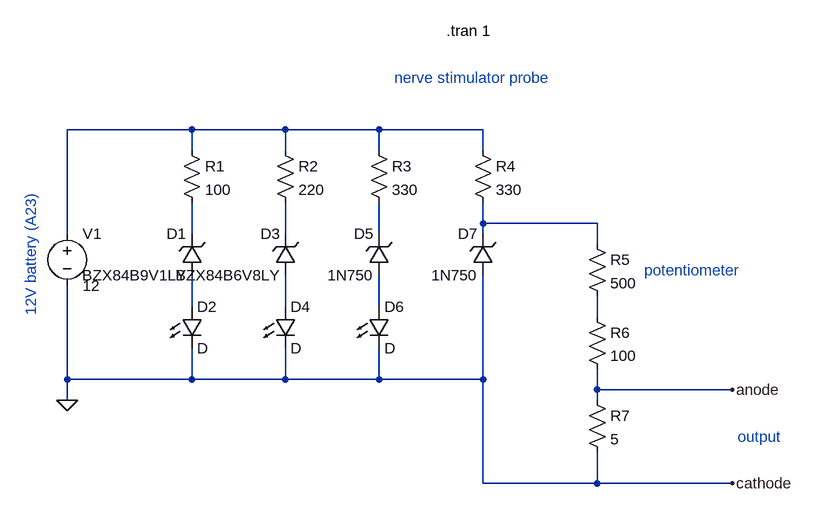
[diagram p0: schematic nerve_stimulator_probe.asc]
nerve_stimulator_probe.asc, the LTspice schematic file:
Version 4
SHEET 1 1136 680
WIRE 192 -32 0 -32
WIRE 336 -32 192 -32
WIRE 480 -32 336 -32
WIRE 640 -32 480 -32
WIRE 192 0 192 -32
WIRE 336 0 336 -32
WIRE 480 0 480 -32
WIRE 640 0 640 -32
WIRE 640 112 640 80
WIRE 816 112 640 112
WIRE 0 128 0 -32
WIRE 192 128 192 80
WIRE 336 128 336 80
WIRE 480 128 480 80
WIRE 640 128 640 112
WIRE 816 144 816 112
WIRE 192 240 192 192
WIRE 336 240 336 192
WIRE 480 240 480 192
WIRE 816 256 816 224
WIRE 0 352 0 208
WIRE 192 352 192 304
WIRE 192 352 0 352
WIRE 336 352 336 304
WIRE 336 352 192 352
WIRE 480 352 480 304
WIRE 480 352 336 352
WIRE 640 352 640 192
WIRE 640 352 480 352
WIRE 816 368 816 336
WIRE 1024 368 816 368
WIRE 0 384 0 352
WIRE 816 384 816 368
WIRE 640 512 640 352
WIRE 816 512 816 464
WIRE 816 512 640 512
WIRE 1024 512 816 512
FLAG 1024 368 anode
FLAG 1024 512 cathode
FLAG 0 384 0
SYMBOL voltage 0 112 R0
WINDOW 123 0 0 Left 0
WINDOW 39 0 0 Left 0
SYMATTR InstName V1
SYMATTR Value 12
SYMBOL res 176 -16 R0
SYMATTR InstName R1
SYMATTR Value 100
SYMBOL zener 208 192 R180
WINDOW 0 24 64 Left 2
WINDOW 3 24 0 Left 2
SYMATTR InstName D1
SYMATTR Value BZX84B9V1LY
SYMBOL LED 176 240 R0
SYMATTR InstName D2
SYMBOL res 320 -16 R0
SYMATTR InstName R2
SYMATTR Value 220
SYMBOL zener 352 192 R180
WINDOW 0 24 64 Left 2
WINDOW 3 24 0 Left 2
SYMATTR InstName D3
SYMATTR Value BZX84B6V8LY
SYMBOL LED 320 240 R0
SYMATTR InstName D4
SYMBOL res 464 -16 R0
SYMATTR InstName R3
SYMATTR Value 330
SYMBOL zener 496 192 R180
WINDOW 0 24 64 Left 2
WINDOW 3 24 0 Left 2
SYMATTR InstName D5
SYMATTR Value 1N750
SYMBOL LED 464 240 R0
SYMATTR InstName D6
SYMBOL res 624 -16 R0
SYMATTR InstName R4
SYMATTR Value 330
SYMBOL zener 656 192 R180
WINDOW 0 24 64 Left 2
WINDOW 3 24 0 Left 2
SYMATTR InstName D7
SYMATTR Value 1N750
SYMBOL res 800 128 R0
SYMATTR InstName R5
SYMATTR Value 500
SYMBOL res 800 240 R0
SYMATTR InstName R6
SYMATTR Value 100
SYMBOL res 800 368 R0
SYMATTR InstName R7
SYMATTR Value 5
TEXT -56 64 VRight 2 ;12V battery (A23)
TEXT 1032 440 Left 2 ;output
TEXT 888 184 Left 2 ;potentiometer
TEXT 504 -112 Left 2 ;nerve stimulator probe
TEXT 584 -184 Left 2 !.tran 1

The netlist it stands for:
* nerve_stimulator_probe.asc
V1 N001 0 12
R1 N001 N003 100
D1 N006 N003 BZX84B9V1LY
D2 N006 0 D
R2 N001 N004 220
D3 N007 N004 BZX84B6V8LY
D4 N007 0 D
R3 N001 N005 330
D5 N008 N005 1N750
D6 N008 0 D
R4 N001 N002 330
D7 0 N002 1N750
R5 N002 N009 500
R6 N009 anode 100
R7 anode 0 5
.model D D
.lib standard.dio
* 12V battery (A23)
* output
* potentiometer
* nerve stimulator probe
.tran 1
.backanno
.end